# EAGLE design stick (EAGLE 6.4)
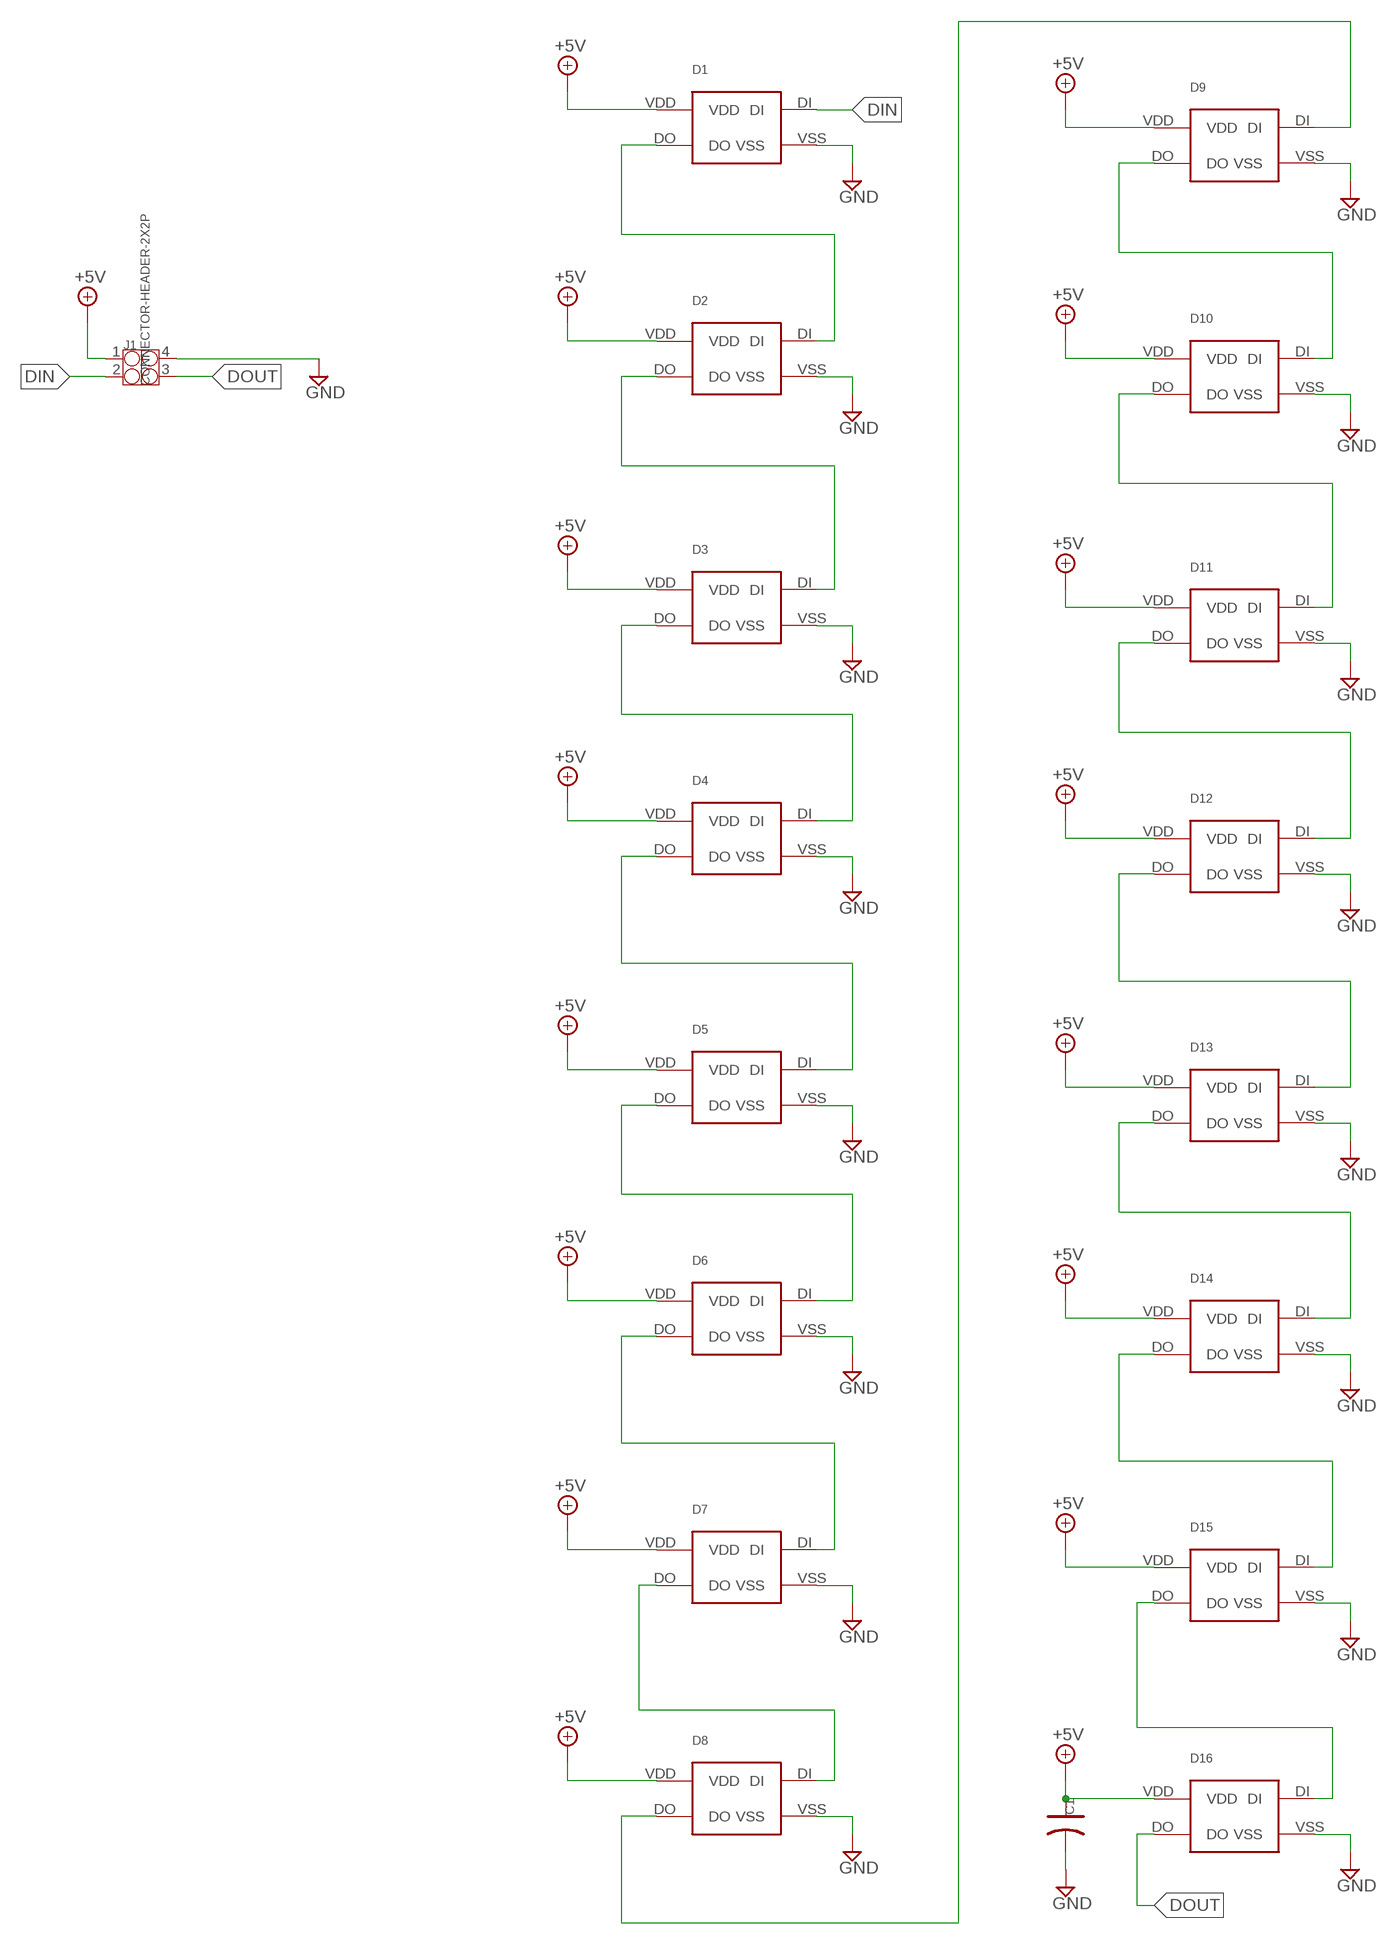
[diagram p0: schematic, sheet 1]

## Parts
C1  C-POLAR-A  [AVX-A]
D1  WS2812B  [WS2812B]
D2  WS2812B  [WS2812B]
D3  WS2812B  [WS2812B]
D4  WS2812B  [WS2812B]
D5  WS2812B  [WS2812B]
D6  WS2812B  [WS2812B]
D7  WS2812B  [WS2812B]
D8  WS2812B  [WS2812B]
D9  WS2812B  [WS2812B]
D10  WS2812B  [WS2812B]
D11  WS2812B  [WS2812B]
D12  WS2812B  [WS2812B]
D13  WS2812B  [WS2812B]
D14  WS2812B  [WS2812B]
D15  WS2812B  [WS2812B]
D16  WS2812B  [WS2812B]
J1  CONNECTOR-HEADER-2X2P  [2X2P-2.54]

## Nets
+5V: C1.+ D1.VDD D2.VDD D3.VDD D4.VDD D5.VDD D6.VDD D7.VDD D8.VDD D9.VDD D10.VDD D11.VDD D12.VDD D13.VDD D14.VDD D15.VDD D16.VDD J1.1
DIN: D1.DI J1.2
DOUT: D16.DO J1.3
GND: C1.- D1.VSS D2.VSS D3.VSS D4.VSS D5.VSS D6.VSS D7.VSS D8.VSS D9.VSS D10.VSS D11.VSS D12.VSS D13.VSS D14.VSS D15.VSS D16.VSS J1.4
N$1: D1.DO D2.DI
N$2: D2.DO D3.DI
N$3: D3.DO D4.DI
N$4: D4.DO D5.DI
N$5: D5.DO D6.DI
N$6: D6.DO D7.DI
N$7: D7.DO D8.DI
N$8: D9.DO D10.DI
N$9: D10.DO D11.DI
N$10: D11.DO D12.DI
N$11: D12.DO D13.DI
N$12: D13.DO D14.DI
N$13: D14.DO D15.DI
N$14: D15.DO D16.DI
N$15: D8.DO D9.DI

## Library data of the parts
C1 = OPL Eagle Library:C-POLAR*
D1-D16 = lumex:WS2812B
J1 = OPL Eagle Library:CONNECTOR-HEADER-2X2P

## Board
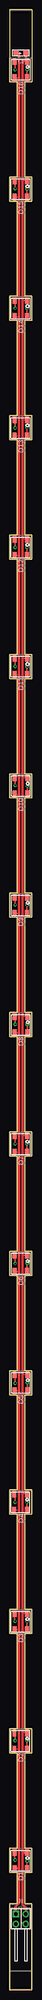
[diagram p1: board, top side]
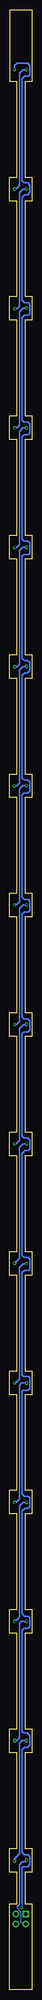
[diagram p2: board, bottom side, seen from below]

Size 5.59 x 497.51 mm. Coordinates in mm from the lower left corner, seen from the top.
Outline: 5.59,0 5.59,21.51 3.78,21.51 3.78,29.51 5.59,29.51 5.59,35.51 3.78,35.51 3.78,59.51 5.59,59.51 5.59,65.51 3.78,65.51 3.78,89.51 5.59,89.51 5.59,95.5 3.78,95.5 3.78,119.51 5.59,119.51 5.59,125.53 3.78,125.53 3.78,149.5 5.59,149.5 5.59,155.52 3.78,155.52 3.78,179.53 5.59,179.53 5.59,185.52 3.78,185.52 3.78,209.52 5.59,209.52 5.59,215.52 3.78,215.52 3.78,239.52 5.59,239.52 5.59,245.52 3.78,245.52 3.78,269.52 5.59,269.52 5.59,275.51 3.78,275.51 3.78,299.52 5.59,299.52 5.59,305.51 3.78,305.51 3.78,329.51 5.59,329.51 5.59,335.51 3.78,335.51 3.78,359.51 5.59,359.51 5.59,365.51 3.78,365.51 3.78,389.51 5.59,389.51 5.59,395.53 3.78,395.53 3.78,419.51 5.59,419.51 5.59,425.53 3.78,425.53 3.78,449.5 5.59,449.5 5.59,455.52 3.78,455.52 3.78,479.53 5.59,479.53 5.59,497.51 0,497.51 0,479.53 1.78,479.53 1.78,455.52 0,455.52 0,449.5 1.78,449.5 1.78,425.53 0,425.53 0,419.51 1.78,419.51 1.78,395.53 0,395.53 0,389.51 1.78,389.51 1.78,365.51 0,365.51 0,359.51 1.78,359.51 1.78,335.51 0,335.51 0,329.51 1.78,329.51 1.78,305.51 0,305.51 0,299.52 1.78,299.52 1.78,275.51 0,275.51 0,269.52 1.78,269.52 1.78,245.52 0,245.52 0,239.52 1.78,239.52 1.78,215.52 0,215.52 0,209.52 1.78,209.52 1.78,185.52 0,185.52 0,179.53 1.78,179.53 1.78,155.52 0,155.52 0,149.5 1.78,149.5 1.78,125.53 0,125.53 0,119.51 1.78,119.51 1.78,95.5 0,95.5 0,89.51 1.78,89.51 1.78,65.51 0,65.51 0,59.51 1.78,59.51 1.78,35.51 0,35.51 0,29.51 1.78,29.51 1.78,21.51 0,21.51 0,0 5.59,0
Copper layers (1*16): Top 0.035mm / dielectric 1.5mm / Bottom 0.035mm
Design rules "default *": minimum track width 10mil, minimum drill 24mil, track to track 8mil, track to pad 8mil, pad to pad 8mil, via to via 8mil, smd to smd 8mil, copper to edge 40mil, drill to drill 8mil, minimum pad ring 10mil, minimum via ring 8mil, stop-mask expansion 4mil, vias tented up to drill 20mil, thermal gap 10mil

### Footprints (pad centres in the part's own frame; a part is rotated, then mirrored left to right if it is on the bottom)
AVX-A = smd 1.27 x 1.27: + -1.27,0; - 1.27,0
WS2812B = smd 1.6 x 1: DI 4.2,0; DO 0.2,-3.2; VDD 0.2,0; VSS 4.2,-3.2
2X2P-2.54 = drill 0.889 pad 1.651 square: 1 -1.27,1.27 | drill 0.889 pad 1.651: 2 -1.27,-1.27; 3 1.27,-1.27; 4 1.27,1.27

### Placement (x,y rotation side)
C1  2.8,486.64 0 top
D1  1.17,30.24 90 top
D2  1.14,60.29 90 top
D3  1.17,90.28 90 top
D4  1.14,120.31 90 top
D5  1.22,150.32 90 top
D6  1.19,180.3 90 top
D7  1.18,210.31 90 top
D8  1.22,240.29 90 top
D9  1.2,270.32 90 top
D10  1.25,300.3 90 top
D11  1.17,330.31 90 top
D12  1.17,360.27 90 top
D13  1.17,390.28 90 top
D14  1.17,420.28 90 top
D15  1.17,450.34 90 top
D16  1.2,480.35 90 top
J1  2.79,17.75 0 top

### Tracks (layer width: path | path; a pad name or v marks a point on that pad's centre or on a via)
+5V
  Top 0.254: 0.91,30.45 D1.VDD
  Top 0.305: D16.VDD 1.26,480.49 2.34,480.49 | D15.VDD 2.36,450.54 2.34,450.62 | D14.VDD 2.36,420.48 2.34,420.5 | D13.VDD 2.36,390.48 2.34,389.94 | D12.VDD 2.36,360.47 2.34,360.2 | D11.VDD 2.36,330.51 2.34,330.38 | D10.VDD 2.36,300.5 2.34,300.13 | D9.VDD 2.36,270.52 2.34,270.64 | D8.VDD 2.36,240.49 2.34,240.61 | D7.VDD 2.36,210.51 2.34,210.46 | D6.VDD 2.36,180.5 2.34,180.09 | D5.VDD 2.36,150.52 2.34,150.47 | D4.VDD 2.36,120.51 2.34,120.75 | D3.VDD 2.36,90.48 2.34,90.45 | D2.VDD 2.36,60.49 2.34,60.58
  Top 0.61: 2.34,30.44 2.34,21.64 1.5,20.75 1.5,19.05 J1.1 | 2.34,30.45 2.25,30.44 D1.VDD | D1.VDD 1.18,30.45 2.34,30.45 | D1.VDD 2.34,30.44 | 2.34,30.44 2.34,30.45 | 2.34,30.45 2.34,60.58 2.34,90.45 2.34,120.75 2.34,150.47 2.34,180.09 2.34,210.46 2.34,240.61 2.34,270.64 2.34,300.13 2.34,330.38 2.34,360.2 2.34,389.94 2.34,420.5 2.34,450.62 2.34,480.49 2.34,486.16 1.88,486.64 C1.+
DIN  (via drill 0.38)
  Top 0.254: 1.27,34.49 D1.DI
  Top 0.406: v1.35,32.54 1.17,32.76 D1.DI
  Bottom 0.254: 3.73,20.83 3.73,20.52 2.82,19.61 2.82,17.07 2.24,16.48 J1.2
  Bottom 0.406: v1.35,32.54 1.78,32.11 2.46,32.11 3.18,31.39 3.18,21.39 3.73,20.83
DOUT  (via drill 0.38)
  Top 0.254: J1.3 3.33,16.48 2.82,16.99 2.82,20.42 v2.67,20.57
  Top 0.406: v4.39,482.52 D16.DO
  Bottom 0.254: 2.46,21.54 2.46,20.78 v2.67,20.57
  Bottom 0.406: v4.39,482.52 4.39,483.57 3.81,484.15 1.04,484.15 0.43,483.54 0.43,481.23 0.81,480.85 1.85,480.85 2.46,480.24 2.46,454.53 2.01,454.08 0.99,454.08 0.43,453.52 0.43,451.66 1.04,451.05 1.7,451.05 2.46,450.29 2.46,424.51 1.93,423.98 0.91,423.98 0.43,423.49 0.43,421.23 0.89,420.78 1.88,420.78 2.46,420.19 2.46,394.46 1.96,393.95 0.97,393.95 0.43,393.42 0.43,391.26 0.91,390.78 1.91,390.78 2.46,390.22 2.46,364.46 1.98,363.98 0.94,363.98 0.43,363.47 0.43,361.06 0.86,360.63 2.03,360.63 2.46,360.2 2.46,334.52 1.93,333.98 0.94,333.98 0.43,333.48 0.43,331.52 1.14,330.81 1.88,330.81 2.46,330.23 2.46,304.5 1.93,303.96 0.97,303.96 0.43,303.43 0.43,301.19 0.94,300.69 1.98,300.69 2.46,300.2 2.46,274.52 1.88,273.94 0.89,273.94 0.43,273.48 0.43,271.17 0.81,270.79 1.93,270.79 2.46,270.26 2.46,244.45 1.96,243.94 0.97,243.94 0.43,243.41 0.43,241.2 0.97,240.66 2.03,240.66 2.46,240.23 2.46,214.48 2.03,214.05 1.04,214.05 0.43,213.44 0.43,211.25 0.86,210.82 1.8,210.82 2.46,210.16 2.46,184.48 1.93,183.95 0.89,183.95 0.43,183.49 0.43,181.08 0.74,180.77 1.93,180.77 2.46,180.24 2.46,154.51 2.11,154.15 0.89,154.15 0.43,153.7 0.43,151.08 0.97,150.55 2.21,150.55 2.46,150.29 2.46,124.51 1.85,123.9 0.81,123.9 0.43,123.52 0.43,121.41 0.94,120.9 1.8,120.9 2.46,120.24 2.46,94.49 1.83,93.85 0.81,93.85 0.43,93.47 0.43,91.31 1.02,90.73 2.03,90.73 2.46,90.3 2.46,64.87 2.08,64.49 1.12,64.49 0.43,63.8 0.43,61.52 1.02,60.93 1.83,60.93 2.46,60.3 2.46,34.44 1.93,33.91 0.97,33.91 0.43,33.38 0.43,31.5 1.02,30.91 2.18,30.91 2.46,30.63 2.46,21.54
GND
  Top 0.305: D15.VSS 3.25,454.54 3.25,454.58 | D14.VSS 3.25,424.48 3.25,423.88 | D13.VSS 3.25,394.48 3.25,394.16 | D12.VSS 3.25,364.47 3.25,364.77 | D11.VSS 3.25,334.51 3.25,334.62 | D10.VSS 3.25,304.5 3.25,304.72 | D9.VSS 3.25,274.52 3.25,274.22 | D8.VSS 3.25,244.49 3.25,244.68 | D7.VSS 3.25,214.51 3.25,214.81 | D6.VSS 3.25,184.5 3.25,184.12 | D5.VSS 3.25,154.52 3.25,154.58 | D4.VSS 3.25,124.51 3.25,124.71 | D3.VSS 3.25,94.48 3.25,94.31 | D2.VSS 3.25,64.49 3.25,63.83
  Top 0.61: 3.25,34.32 3.25,21.36 4.09,20.52 4.09,19.05 J1.4 | 3.25,34.32 3.25,34.37 3.38,34.44 D1.VSS | D1.VSS 4.24,34.32 3.25,34.32 | D1.VSS 3.25,34.44 3.25,63.83 3.25,94.31 3.25,124.71 3.25,154.58 3.25,184.12 3.25,214.81 3.25,244.68 3.25,274.22 3.25,304.72 3.25,334.62 3.25,364.77 3.25,394.16 3.25,423.88 3.25,454.58 3.25,484.78 4.07,484.78 | D16.VSS 4.4,484.78 4.07,484.78 | 4.07,484.78 C1.-
N$1  (via drill 0.38)
  Top 0.406: D1.DO 4.39,30.47 v4.39,32.31 | v1.35,62.59 1.35,64.29 D2.DI
  Bottom 0.406: v4.39,32.31 4.37,32.33 4.37,32.92 3.15,34.14 3.15,61.82 2.39,62.59 v1.35,62.59
N$2  (via drill 0.38)
  Top 0.406: D2.DO 4.34,62.53 v4.32,62.56 | v1.35,92.58 1.17,92.76 D3.DI
  Bottom 0.406: v4.32,62.56 3.91,62.56 3.15,63.32 3.15,92 2.57,92.58 v1.35,92.58
N$3  (via drill 0.38)
  Top 0.406: D3.DO v4.37,92.53 | v1.35,122.45 1.35,124.3 D4.DI
  Bottom 0.406: v4.37,92.53 4.22,92.53 3.15,93.6 3.15,121.54 2.24,122.45 v1.35,122.45
N$4  (via drill 0.38)
  Top 0.406: D4.DO v4.34,122.4 | v1.35,152.4 1.35,154.39 D5.DI
  Bottom 0.406: v4.34,122.4 4.06,122.4 3.15,123.32 3.15,151.82 2.57,152.4 v1.35,152.4
N$5  (via drill 0.38)
  Top 0.406: D5.DO v4.42,152.47 v4.42,152.48 | v1.35,182.47 1.35,184.34 D6.DI
  Bottom 0.406: v4.42,152.48 4.17,152.48 3.15,153.49 3.15,181.48 2.26,182.37 1.45,182.37 v1.35,182.47
N$6  (via drill 0.38)
  Top 0.406: D6.DO v4.39,182.55 | v1.35,212.52 1.35,214.34 D7.DI
  Bottom 0.406: v4.39,182.55 4.29,182.55 3.15,183.69 3.15,211.63 2.26,212.52 v1.35,212.52
N$7  (via drill 0.38)
  Top 0.406: D7.DO 4.38,212.51 v4.37,212.52 | v1.35,242.6 1.35,244.37 D8.DI
  Bottom 0.406: v4.37,212.52 3.96,212.52 3.15,213.33 3.15,241.55 2.26,242.44 1.5,242.44 v1.35,242.6
N$8  (via drill 0.38)
  Top 0.406: D9.DO v4.4,272.51 v4.39,272.52 | v1.35,302.59 1.35,304.41 D10.DI
  Bottom 0.406: v4.39,272.52 3.96,272.52 3.15,273.33 3.15,301.7 2.26,302.59 v1.35,302.59
N$9  (via drill 0.38)
  Top 0.406: D10.DO v4.45,302.48 v4.45,302.49 | v1.35,332.54 1.35,334.34 D11.DI
  Bottom 0.406: v4.45,302.49 3.94,302.49 3.15,303.28 3.15,331.65 2.26,332.54 v1.35,332.54
N$10  (via drill 0.38)
  Top 0.406: D11.DO v4.37,332.4 v4.37,332.41 | v1.35,362.46 1.35,364.3 D12.DI
  Bottom 0.406: v4.37,332.41 3.91,332.41 3.15,333.17 3.15,361.57 2.26,362.46 v1.35,362.46
N$11  (via drill 0.38)
  Top 0.406: D12.DO v4.37,362.4 v4.37,362.41 | v1.35,392.48 1.35,394.3 D13.DI
  Bottom 0.406: v4.37,362.41 3.84,362.41 3.15,363.09 3.15,391.59 2.26,392.48 v1.35,392.48
N$12  (via drill 0.38)
  Top 0.406: D13.DO v4.37,392.5 v4.37,392.51 | v1.35,422.55 1.35,424.31 D14.DI
  Bottom 0.406: v4.37,392.51 3.78,392.51 3.15,393.14 3.15,421.67 2.26,422.55 v1.35,422.55
N$13  (via drill 0.38)
  Top 0.406: D14.DO v4.37,422.45 | v1.35,452.63 1.35,454.37 D15.DI
  Bottom 0.406: v4.37,422.45 3.76,422.45 3.15,423.06 3.15,451.61 2.26,452.5 1.47,452.5 v1.35,452.63
N$14  (via drill 0.38)
  Top 0.406: D15.DO v4.37,452.52 v4.37,452.53 | v1.35,482.52 1.35,484.4 D16.DI
  Bottom 0.406: v4.37,452.53 3.94,452.53 3.15,453.31 3.15,481.63 2.26,482.52 v1.35,482.52
N$15  (via drill 0.38)
  Top 0.406: D8.DO v4.42,242.54 | v1.35,272.59 1.35,274.38 D9.DI
  Bottom 0.406: v4.42,242.54 3.89,242.54 3.15,243.28 3.15,271.7 2.26,272.59 v1.35,272.59